# EAGLE design Dual6x09_CoCo2 (EAGLE 7.7.0)
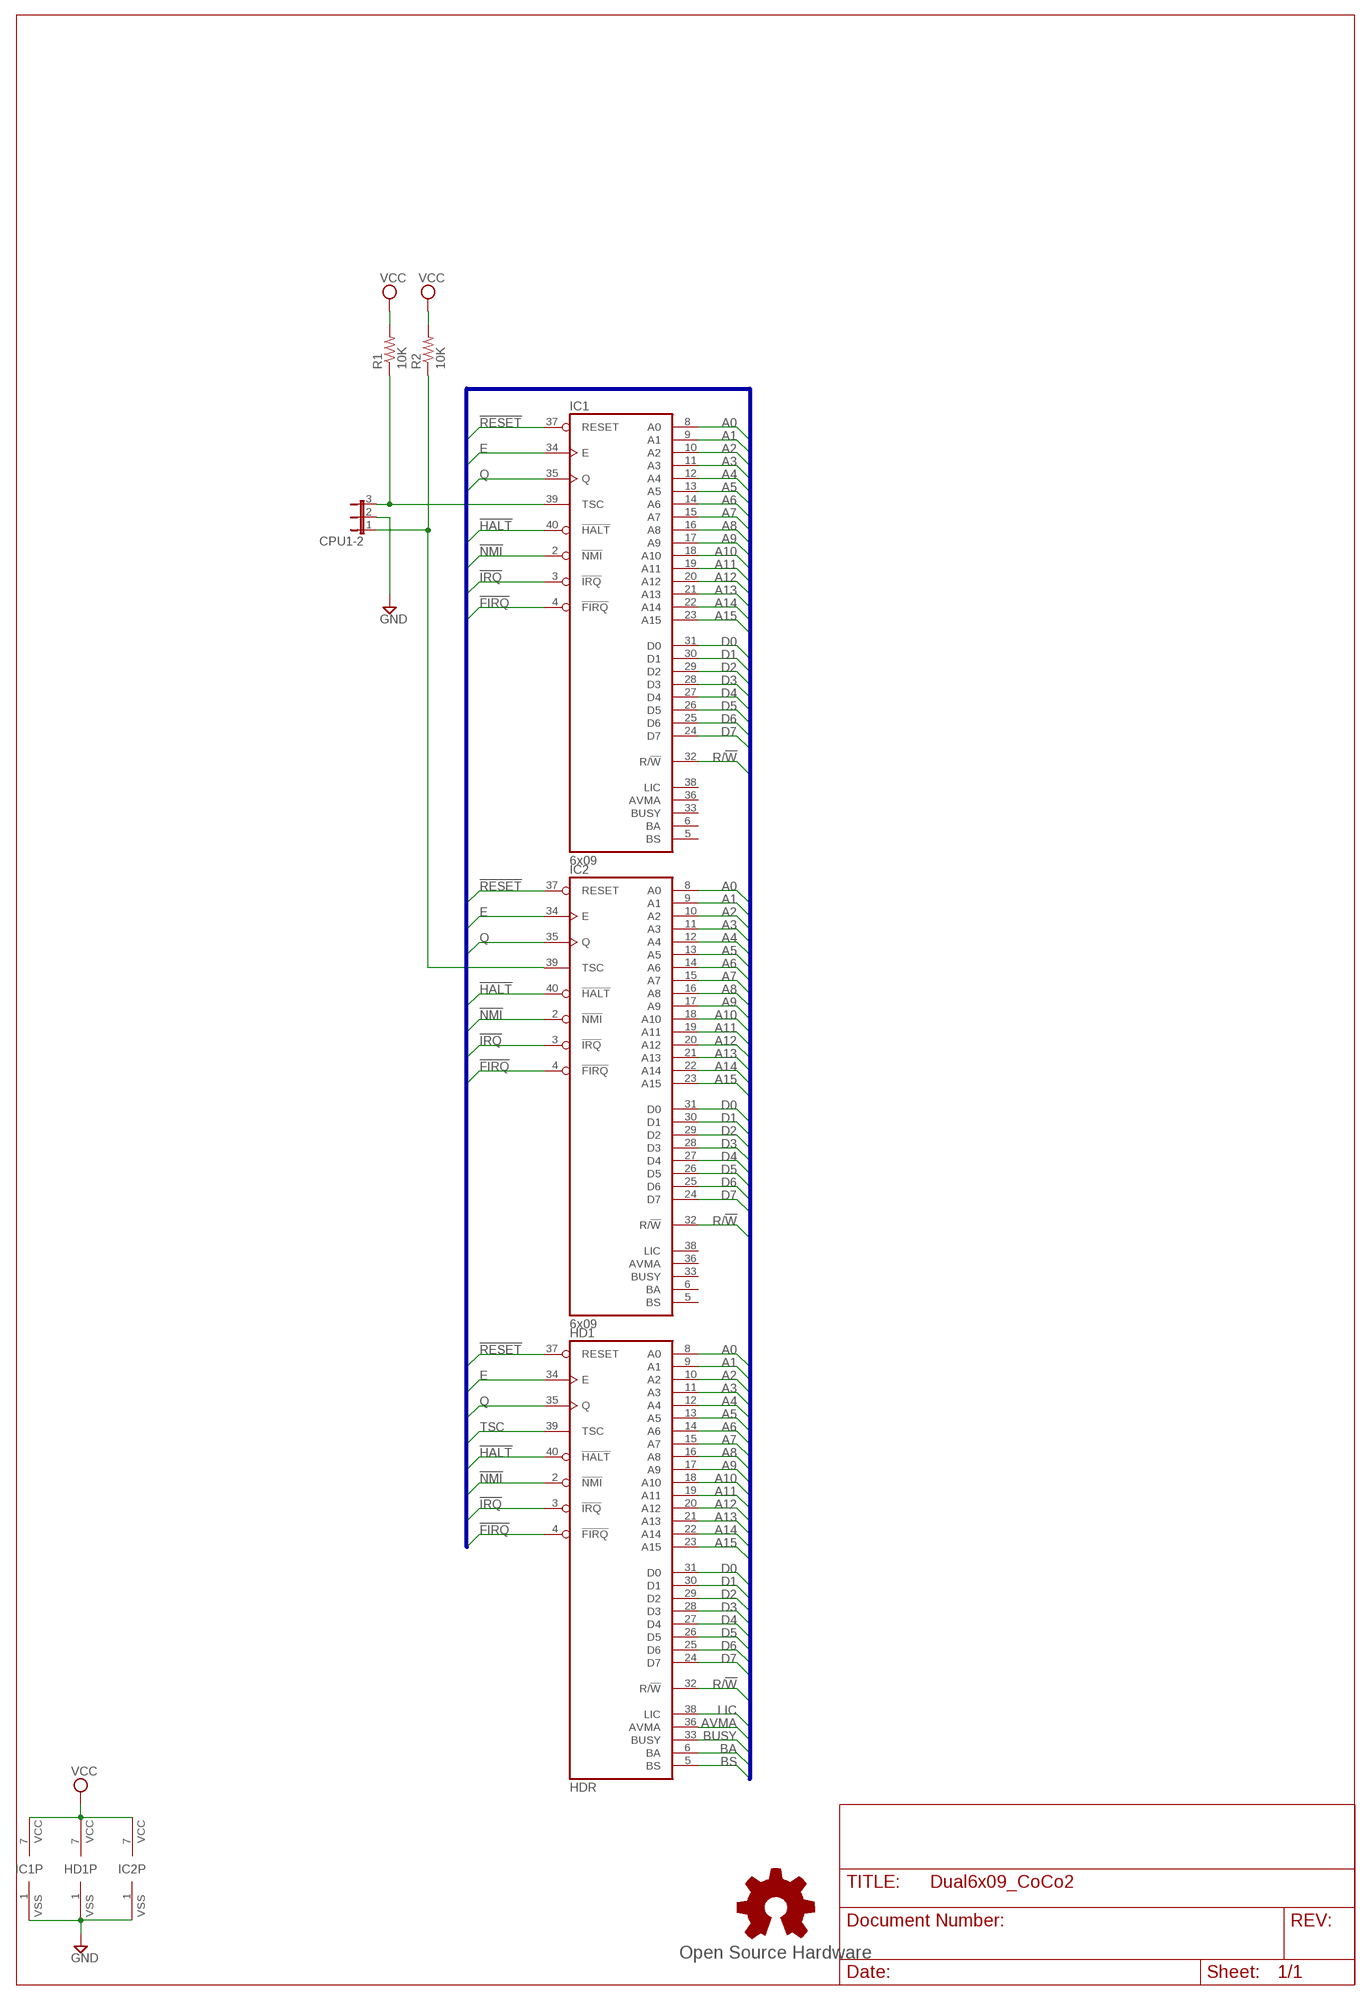
[diagram p0: schematic, sheet 1]

## Parts
CPU1-2  JP2E  [JP2]
GOLD_ORB_SM1  Open Source Hardware  OSHWLOGOLOGO5MM  [OSHW_5MM]
HD1  HDR  MC6809ER  [DIL40-ROUNDPAD]
IC1  6x09  MC6809ER  [DIL40-ROUNDPAD]
IC2  6x09  MC6809ER  [DIL40-ROUNDPAD]
R1  10K  R-US_0204/2V  [0204V]
R2  10K  R-US_0204/2V  [0204V]

## Nets
!FIRQ: HD1.4(!FIRQ) IC1.4(!FIRQ) IC2.4(!FIRQ)
!HALT: HD1.40(!HALT) IC1.40(!HALT) IC2.40(!HALT)
!IRQ: HD1.3(!IRQ) IC1.3(!IRQ) IC2.3(!IRQ)
!NMI: HD1.2(!NMI) IC1.2(!NMI) IC2.2(!NMI)
!RESET: HD1.37(RESET) IC1.37(RESET) IC2.37(RESET)
A0: HD1.8(A0) IC1.8(A0) IC2.8(A0)
A1: HD1.9(A1) IC1.9(A1) IC2.9(A1)
A2: HD1.10(A2) IC1.10(A2) IC2.10(A2)
A3: HD1.11(A3) IC1.11(A3) IC2.11(A3)
A4: HD1.12(A4) IC1.12(A4) IC2.12(A4)
A5: HD1.13(A5) IC1.13(A5) IC2.13(A5)
A6: HD1.14(A6) IC1.14(A6) IC2.14(A6)
A7: HD1.15(A7) IC1.15(A7) IC2.15(A7)
A8: HD1.16(A8) IC1.16(A8) IC2.16(A8)
A9: HD1.17(A9) IC1.17(A9) IC2.17(A9)
A10: HD1.18(A10) IC1.18(A10) IC2.18(A10)
A11: HD1.19(A11) IC1.19(A11) IC2.19(A11)
A12: HD1.20(A12) IC1.20(A12) IC2.20(A12)
A13: HD1.21(A13) IC1.21(A13) IC2.21(A13)
A14: HD1.22(A14) IC1.22(A14) IC2.22(A14)
A15: HD1.23(A15) IC1.23(A15) IC2.23(A15)
AVMA: HD1.36(AVMA)
BA: HD1.6(BA)
BS: HD1.5(BS)
BUSY: HD1.33(BUSY)
D0: HD1.31(D0) IC1.31(D0) IC2.31(D0)
D1: HD1.30(D1) IC1.30(D1) IC2.30(D1)
D2: HD1.29(D2) IC1.29(D2) IC2.29(D2)
D3: HD1.28(D3) IC1.28(D3) IC2.28(D3)
D4: HD1.27(D4) IC1.27(D4) IC2.27(D4)
D5: HD1.26(D5) IC1.26(D5) IC2.26(D5)
D6: HD1.25(D6) IC1.25(D6) IC2.25(D6)
D7: HD1.24(D7) IC1.24(D7) IC2.24(D7)
E: HD1.34(E) IC1.34(E) IC2.34(E)
GND: CPU1-2.2 HD1.1(VSS) IC1.1(VSS) IC2.1(VSS)
LIC: HD1.38(LIC)
N$1: CPU1-2.1 IC2.39(TSC) R2.1
N$2: CPU1-2.3 IC1.39(TSC) R1.1
Q: HD1.35(Q) IC1.35(Q) IC2.35(Q)
R/!W: HD1.32(R/!W) IC1.32(R/!W) IC2.32(R/!W)
TSC: HD1.39(TSC)
VCC: HD1.7(VCC) IC1.7(VCC) IC2.7(VCC) R1.2 R2.2
Unconnected: IC1.5(BS) IC1.6(BA) IC1.33(BUSY) IC1.36(AVMA) IC1.38(LIC) IC2.5(BS) IC2.6(BA) IC2.33(BUSY) IC2.36(AVMA) IC2.38(LIC)

## Buses
TSC,LIC,!RESET,!NMI,!HALT,!IRQ,!FIRQ,AVMA,BUSY,A[0..15],D[0..7],E,Q,BA,BS,R/!W

## Library data of the parts
CPU1-2 = jumper:JP2E: JUMPER
GOLD_ORB_SM1 = oshw:OSHWLOGO: The OSHW logo for PCB layout
HD1 IC1 IC2 = micro-motorola:MC6809E: MICROCONTROLLER/MEMORY DEVICE
R1 R2 = resistor:R-US_: RESISTOR, American symbol

## Board
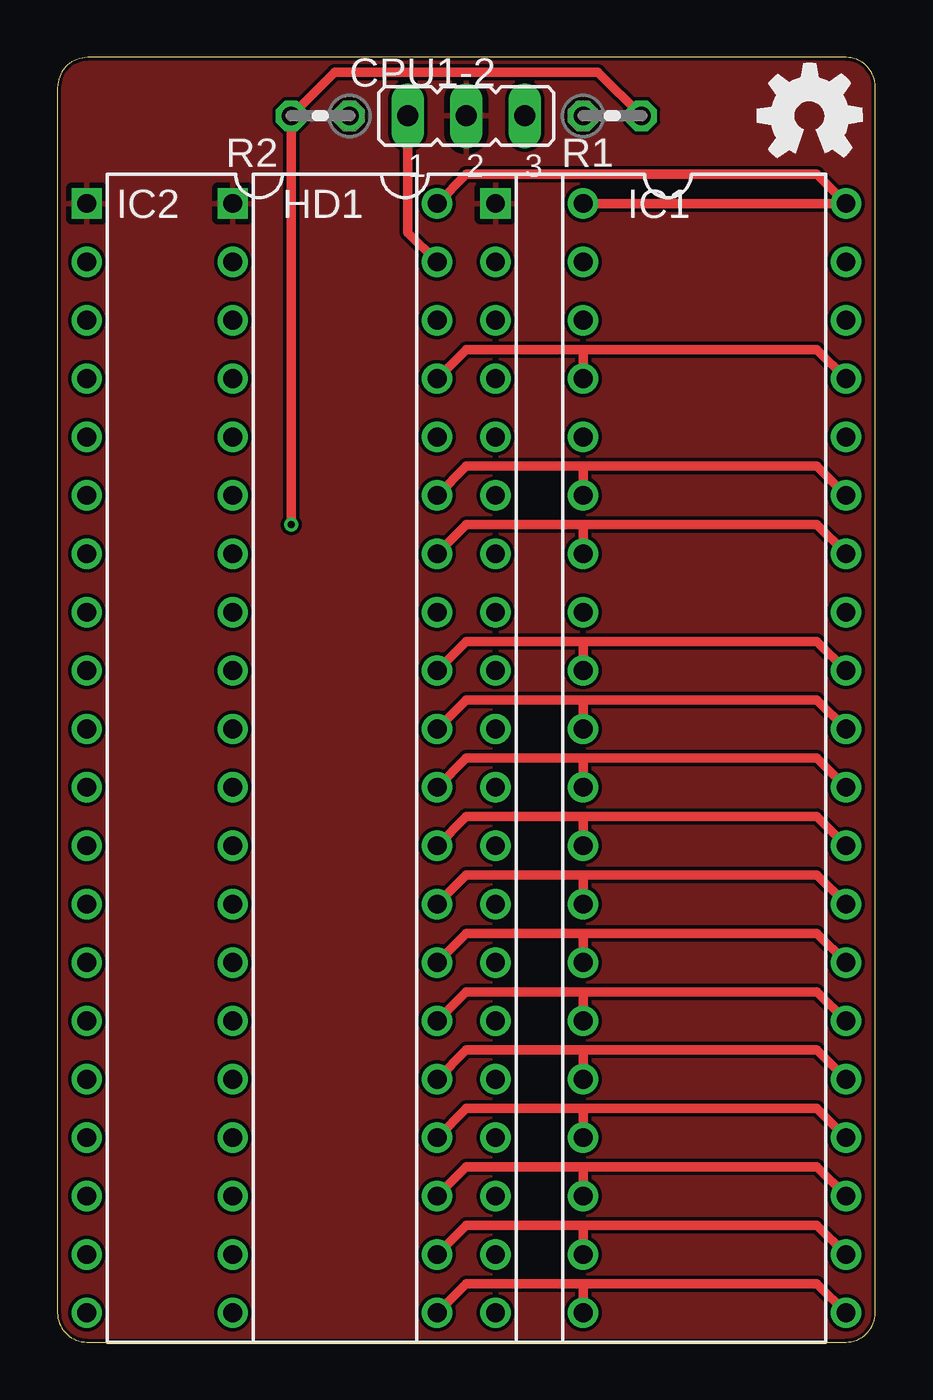
[diagram p1: board, top side]
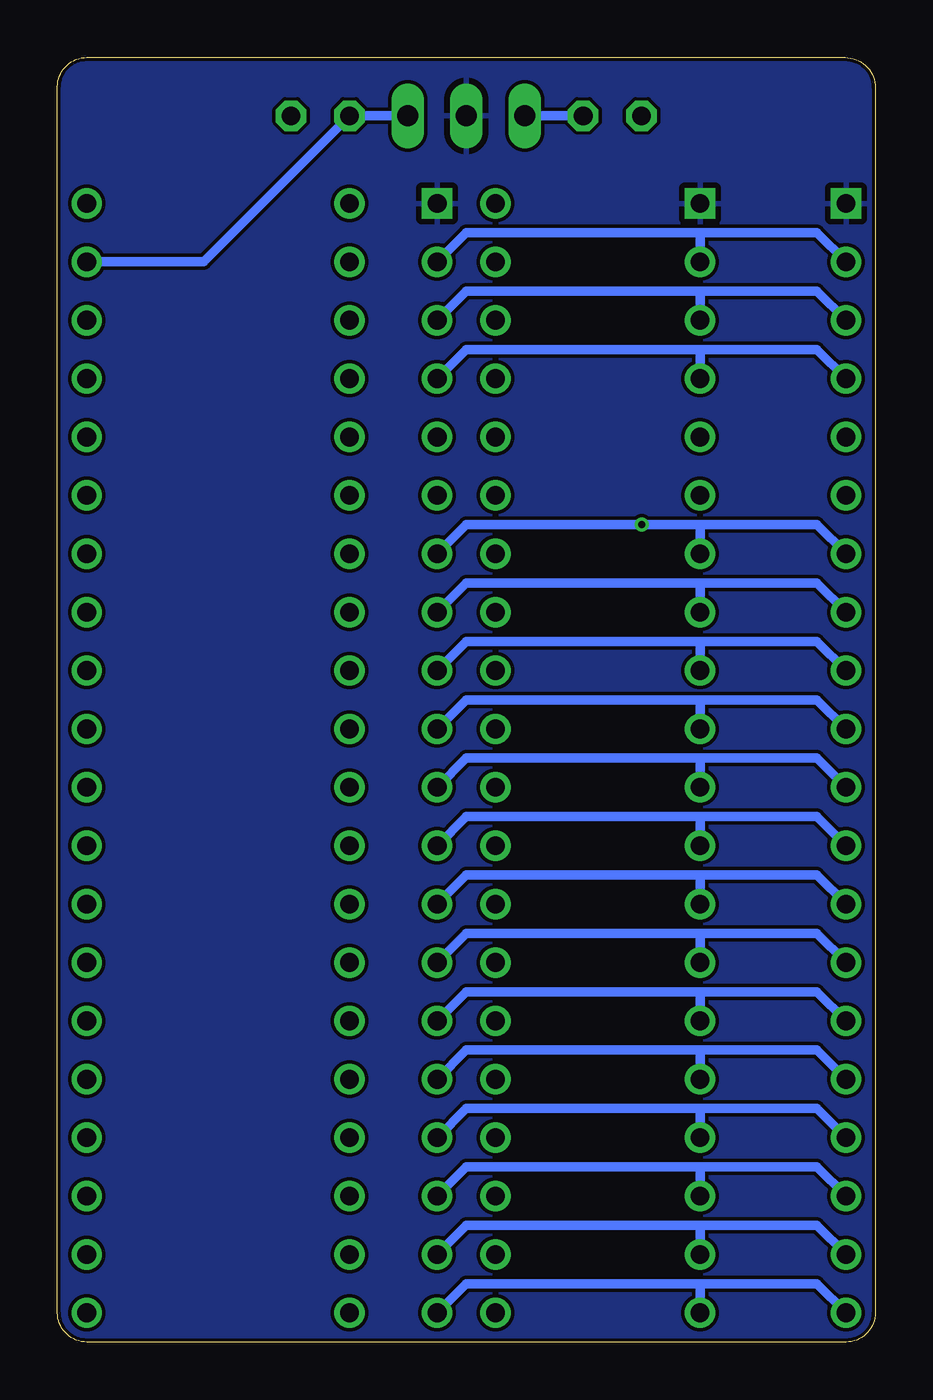
[diagram p2: board, bottom side, seen from below]

Size 35.56 x 55.88 mm. Coordinates in mm from the lower left corner, seen from the top.
Outline: 34.29,55.88 1.31,55.88 arc90 0,54.57 0,1.27 arc90 1.27,0 34.29,0 arc90 35.56,1.27 35.56,54.61 arc90 34.29,55.88
Copper layers (1*16): Top 0.035mm / dielectric 1.5mm / Bottom 0.035mm
Design rules "hackvana *": minimum track width 6mil, minimum drill 0.3mm, track to track 6mil, track to pad 6mil, pad to pad 6mil, via to via 6mil, smd to smd 0mil, copper to edge 6mil, drill to drill 6mil, minimum pad ring 10mil, minimum via ring 6mil, stop-mask expansion 2mil, vias tented up to drill 100mil, thermal gap 10mil

### Footprints (pad centres in the part's own frame; a part is rotated, then mirrored left to right if it is on the bottom)
JP2 = drill 0.914 long: 1 -2.54,0; 2 0,0; 3 2.54,0
DIL40-ROUNDPAD = drill 0.813 square: 1 -24.13,-7.62 | drill 0.813: 2 -21.59,-7.62; 3 -19.05,-7.62; 4 -16.51,-7.62; 5 -13.97,-7.62; 6 -11.43,-7.62; 7 -8.89,-7.62; 8 -6.35,-7.62; 9 -3.81,-7.62; 10 -1.27,-7.62; 11 1.27,-7.62; 12 3.81,-7.62; 13 6.35,-7.62; 14 8.89,-7.62; 15 11.43,-7.62; 16 13.97,-7.62; 17 16.51,-7.62; 18 19.05,-7.62; 19 21.59,-7.62; 20 24.13,-7.62; 21 24.13,7.62; 22 21.59,7.62; 23 19.05,7.62; 24 16.51,7.62; 25 13.97,7.62; 26 11.43,7.62; 27 8.89,7.62; 28 6.35,7.62; 29 3.81,7.62; 30 1.27,7.62; 31 -1.27,7.62; 32 -3.81,7.62; 33 -6.35,7.62; 34 -8.89,7.62; 35 -11.43,7.62; 36 -13.97,7.62; 37 -16.51,7.62; 38 -19.05,7.62; 39 -21.59,7.62; 40 -24.13,7.62
0204V = drill 0.813 octagon: 1 -1.27,0; 2 1.27,0

### Placement (x,y rotation side)
CPU1-2  17.78,53.34 0 top
GOLD_ORB_SM1  32.7,53.34 0 top
HD1  15.24,25.4 270 top
IC1  26.67,25.4 270 top
IC2  8.89,25.4 270 top
R1  24.13,53.34 0 top
R2  11.43,53.34 180 top

### Tracks (layer width: path | path; a pad name or v marks a point on that pad's centre or on a via)
!FIRQ
  Bottom 0.406: IC2.4 2.54,43.18 7.62,43.18 | 7.62,43.18 17.78,43.18 IC1.4 | HD1.4 7.62,43.18
!HALT
  Top 0.406: HD1.40 IC1.40 33.02,50.8 17.78,50.8 IC2.40
!IRQ
  Bottom 0.406: IC1.3 17.78,45.72 7.62,45.72 | 7.62,45.72 2.54,45.72 IC2.3 | HD1.3 7.62,45.72
!NMI
  Bottom 0.406: IC1.2 17.78,48.26 7.62,48.26 | 7.62,48.26 2.54,48.26 IC2.2 | HD1.2 7.62,48.26
!RESET
  Top 0.406: IC1.37 33.02,43.18 22.86,43.18 | 22.86,43.18 17.78,43.18 IC2.37 | HD1.37 22.86,43.18
A0
  Bottom 0.406: IC2.8 2.54,33.02 7.62,33.02 | 7.62,33.02 17.78,33.02 IC1.8 | HD1.8 7.62,33.02
A1
  Bottom 0.406: IC2.9 2.54,30.48 7.62,30.48 | 7.62,30.48 17.78,30.48 IC1.9 | HD1.9 7.62,30.48
A2
  Bottom 0.406: IC2.10 2.54,27.94 7.62,27.94 | 7.62,27.94 17.78,27.94 IC1.10 | HD1.10 7.62,27.94
A3
  Bottom 0.406: IC2.11 2.54,25.4 7.62,25.4 | 7.62,25.4 17.78,25.4 IC1.11 | HD1.11 7.62,25.4
A4
  Bottom 0.406: IC1.12 17.78,22.86 7.62,22.86 | 7.62,22.86 2.54,22.86 IC2.12 | HD1.12 7.62,22.86
A5
  Bottom 0.406: IC2.13 2.54,20.32 7.62,20.32 | 7.62,20.32 17.78,20.32 IC1.13 | HD1.13 7.62,20.32
A6
  Bottom 0.406: IC1.14 17.78,17.78 7.62,17.78 | 7.62,17.78 2.54,17.78 IC2.14 | HD1.14 7.62,17.78
A7
  Bottom 0.406: IC2.15 2.54,15.24 7.62,15.24 | 7.62,15.24 17.78,15.24 IC1.15 | HD1.15 7.62,15.24
A8
  Bottom 0.406: IC1.16 17.78,12.7 7.62,12.7 | 7.62,12.7 2.54,12.7 IC2.16 | HD1.16 7.62,12.7
A9
  Bottom 0.406: IC2.17 2.54,10.16 7.62,10.16 | 7.62,10.16 17.78,10.16 IC1.17 | HD1.17 7.62,10.16
A10
  Bottom 0.406: IC1.18 17.78,7.62 7.62,7.62 | 7.62,7.62 2.54,7.62 IC2.18 | HD1.18 7.62,7.62
A11
  Bottom 0.406: IC2.19 2.54,5.08 7.62,5.08 | 7.62,5.08 17.78,5.08 IC1.19 | HD1.19 7.62,5.08
A12
  Bottom 0.406: IC1.20 17.78,2.54 7.62,2.54 | 7.62,2.54 2.54,2.54 IC2.20 | HD1.20 7.62,2.54
A13
  Top 0.406: IC2.21 17.78,2.54 22.86,2.54 | 22.86,2.54 33.02,2.54 IC1.21 | HD1.21 22.86,2.54
A14
  Top 0.406: IC1.22 33.02,5.08 22.86,5.08 | 22.86,5.08 17.78,5.08 IC2.22 | HD1.22 22.86,5.08
A15
  Top 0.406: IC2.23 17.78,7.62 22.86,7.62 | 22.86,7.62 33.02,7.62 IC1.23 | HD1.23 22.86,7.62
D0
  Top 0.406: IC2.31 17.78,27.94 22.86,27.94 | 22.86,27.94 33.02,27.94 IC1.31 | HD1.31 22.86,27.94
D1
  Top 0.406: IC2.30 17.78,25.4 22.86,25.4 | 22.86,25.4 33.02,25.4 IC1.30 | HD1.30 22.86,25.4
D2
  Top 0.406: IC2.29 17.78,22.86 22.86,22.86 | 22.86,22.86 33.02,22.86 IC1.29 | HD1.29 22.86,22.86
D3
  Top 0.406: IC1.28 33.02,20.32 22.86,20.32 | 22.86,20.32 17.78,20.32 IC2.28 | HD1.28 22.86,20.32
D4
  Top 0.406: IC2.27 17.78,17.78 22.86,17.78 | 22.86,17.78 33.02,17.78 IC1.27 | HD1.27 22.86,17.78
D5
  Top 0.406: IC1.26 33.02,15.24 22.86,15.24 | 22.86,15.24 17.78,15.24 IC2.26 | HD1.26 22.86,15.24
D6
  Top 0.406: IC2.25 17.78,12.7 22.86,12.7 | 22.86,12.7 33.02,12.7 IC1.25 | HD1.25 22.86,12.7
D7
  Top 0.406: IC1.24 33.02,10.16 22.86,10.16 | 22.86,10.16 17.78,10.16 IC2.24 | HD1.24 22.86,10.16
E
  Top 0.406: IC1.34 33.02,35.56 22.86,35.56 | 22.86,35.56 17.78,35.56 IC2.34 | HD1.34 22.86,35.56
GND
  pour Bottom: 0,1.27 0,54.57 arc-90 1.31,55.88 34.29,55.88 arc-90 35.56,54.61 35.56,1.27 arc-90 34.29,0 1.27,0 arc-90
  pour Top: 0,1.27 0,54.57 arc-90 1.31,55.88 34.29,55.88 arc-90 35.56,54.61 35.56,1.27 arc-90 34.29,0 1.27,0 arc-90
N$1
  Top 0.406: CPU1-2.1 15.24,48.26 IC2.39
  Bottom 0.406: CPU1-2.1 R2.1
N$2
  Bottom 0.406: CPU1-2.3 R1.1 29.21,46.99 IC1.39
Q
  Top 0.406: IC2.35 17.78,38.1 22.86,38.1 | 22.86,38.1 33.02,38.1 IC1.35 | HD1.35 22.86,38.1
R/!W
  Top 0.406: IC2.32 17.78,30.48 22.86,30.48 | 22.86,30.48 33.02,30.48 IC1.32 | HD1.32 22.86,30.48
VCC  (via drill 0.3)
  Top 0.406: R1.2 23.5,55.24 12.06,55.24 R2.2 v10.16,35.56
  Bottom 0.406: IC2.7 2.54,35.56 7.62,35.56 | 7.62,35.56 v10.16,35.56 17.78,35.56 IC1.7 | HD1.7 7.62,35.56

### Text on the board
tValues: (c) 2017 / RETRO Innovations / www.go4retro.com